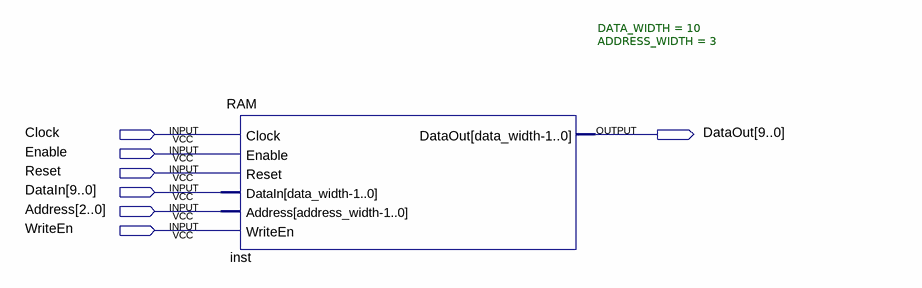
[diagram p0: schematic sheet]
// Quartus schematic Block1.bdf as structural Verilog: 1 symbols, 7 pins
module Block1 (
  input  Clock,
  input  Enable,
  input  Reset,
  input  [9:0] DataIn,
  input  [2:0] Address,
  input  WriteEn,
  output [9:0] DataOut
);

  RAM #(.DATA_WIDTH(10), .ADDRESS_WIDTH(3)) inst (
    .Clock(Clock), .Enable(Enable), .Reset(Reset), .DataIn(DataIn), .Address(Address), .WriteEn(WriteEn),
    .DataOut(DataOut));
endmodule
